# EAGLE design SparkFun_Qwiic_Micro_SAMD21E (EAGLE 9.6.2)
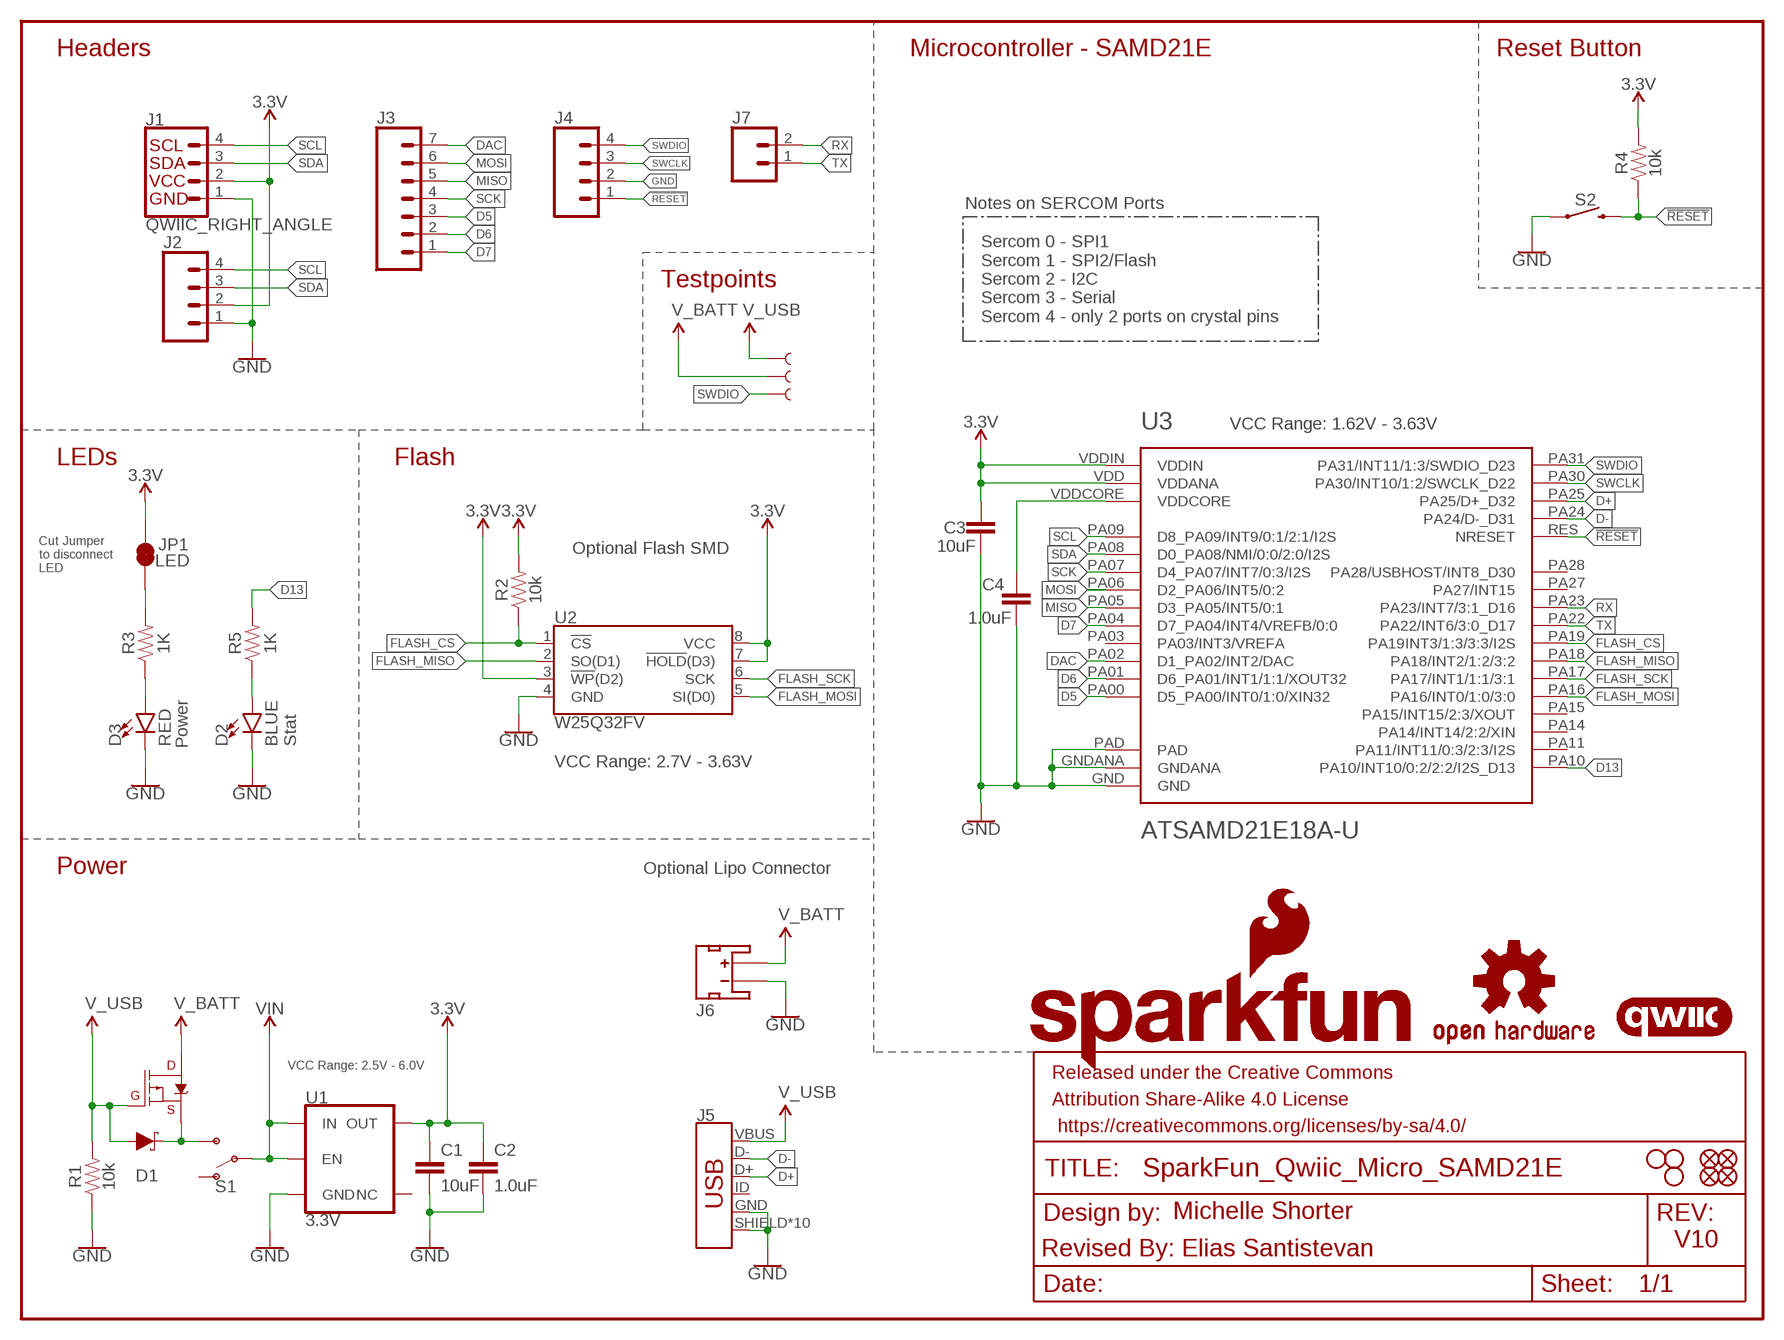
[diagram p0: schematic, sheet 1]

## Parts
C1  10uF  10UF-0603-6.3V-20%  [0603]
C2  1.0uF  1.0UF-0402-16V-10%  [0402]
C3  10uF  10UF-0603-6.3V-20%  [0603]
C4  1.0uF  1.0UF-0402-16V-10%  [0402]
D1  1A/23V/620mV  DIODE-SCHOTTKY-BAT20J  [SOD-323]
D2  BLUE  LED-BLUE0603  [LED-0603]
D3  RED  LED-RED0603  [LED-0603]
FD1  FIDUCIALUFIDUCIAL  [FIDUCIAL-MICRO]
FD2  FIDUCIALUFIDUCIAL  [FIDUCIAL-MICRO]
FD3  FIDUCIALUFIDUCIAL  [FIDUCIAL-MICRO]
FD4  FIDUCIALUFIDUCIAL  [FIDUCIAL-MICRO]
FRAME1  FRAME-LETTER  [CREATIVE_COMMONS]
H1  STAND-OFF  [STAND-OFF]
H2  STAND-OFF  [STAND-OFF]
H3  STAND-OFF  [STAND-OFF]
J1  QWIIC_RIGHT_ANGLE  QWIIC_CONNECTORJS-1MM  [JST04_1MM_RA]
J2  CONN_041X04_NO_SILK  [1X04_NO_SILK]
J3  CONN_07NO_SILK  [1X07_NO_SILK]
J4  CONN_041.27MM_NO_SILK  [1X04_1.27MM_NO_SILK]
J5  USB_MICRO-B_HALF_PTH_MILL  [USB-MICROB-PTH-MILL]
J6  JST_2MM_MALE  [JST-2-SMD]
J7  CONN_021X02_NO_SILK  [1X02_NO_SILK]
JP1  LED  JUMPER-SMT_2_NC_TRACE_SILK  [SMT-JUMPER_2_NC_TRACE_SILK]
LOGO1  SFE_LOGO_NAME.1_INCH  [SFE_LOGO_NAME_.1]
LOGO2  SFE_LOGO_FLAME.2_INCH  [SFE_LOGO_FLAME_.2]
LOGO3  OSHW-LOGOS  [OSHW-LOGO-S]
LOGO4  QWIIC_LOGO_3MM  [QWIIC_3MM]
Q1  3.1A/30V/105mΩ  MOSFET_PCH-DMG2307L  [SOT23-3]
R1  10k  10KOHM-0402-1/16W-1%  [0402]
R2  10k  10KOHM-0402-1/16W-1%  [0402]
R3  1K  1KOHM-0402-1/16W-1%  [0402]
R4  10k  10KOHM-0402-1/16W-1%  [0402]
R5  1K  1KOHM-0402-1/16W-1%  [0402]
S1  SWITCH-SPDT-SMD-RIGHT-ANGLE  [SWITCH_SPST_SMD_A]
S2  MOMENTARY-SWITCH-SPST-SMD-4.6X2.8MM  [TACTILE_SWITCH_SMD_4.6X2.8MM]
TP1  TEST-POINTTP_15TH_THRU  [TP_15TH]
TP2  TEST-POINTTP_15TH_THRU  [TP_15TH]
TP3  TEST-POINTTP_15TH_THRU  [TP_15TH]
U1  3.3V  V_REG_AP2112K-3.3V  [SOT23-5]
U2  W25Q32FV  W25Q32FVSS  [SOIC-8]
U3  ATSAMD21E18A-U  [QFN-32_SAMD]

## Nets
3.3V: C1.1 C2.1 C3.1 J1.2 J2.2 JP1.2 R2.2 R4.2 U1.5(OUT) U2.3(!WP!(D2)) U2.7(!HOLD!(D3)) U2.8(VCC) U3.VDD(VDDANA) U3.VDDIN
!RESET: J4.1 R4.1 S2.3 S2.4 U3.RES(NRESET)
D5: J3.3 U3.PA00(D5_PA00/INT0/1:0/XIN32)
D6: J3.2 U3.PA01(D6_PA01/INT1/1:1/XOUT32)
D7: J3.1 U3.PA04(D7_PA04/INT4/VREFB/0:0)
D13: R5.2 U3.PA10(PA10/INT10/0:2/2:2/I2S_D13)
D+: J5.D+ U3.PA25(PA25/D+_D32)
D-: J5.D- U3.PA24(PA24/D-_D31)
DAC: J3.7 U3.PA02(D1_PA02/INT2/DAC)
FLASH_CS: R2.1 U2.1(!CS!) U3.PA19(PA19INT3/1:3/3:3/I2S)
FLASH_MISO: U2.2(SO(D1)) U3.PA18(PA18/INT2/1:2/3:2)
FLASH_MOSI: U2.5(SI(D0)) U3.PA16(PA16/INT0/1:0/3:0)
FLASH_SCK: U2.6(SCK) U3.PA17(PA17/INT1/1:1/3:1)
GND: C1.2 C2.2 C3.2 C4.1 D2.C D3.C J1.1 J2.1 J4.2 J5.GND J5.SHIELD J5.SHIELD2(SHIELD) J5.SHIELD3(SHIELD) J5.SHIELD4(SHIELD) J5.SHIELD5(SHIELD) J5.SHIELD6(SHIELD) J5.SHIELD7(SHIELD) J5.SHIELD8(SHIELD) J5.SHIELD9(SHIELD) J5.SHIELD10(SHIELD) J6.1(-) R1.1 S2.1 S2.2 U1.2(GND) U2.4(GND) U3.GND U3.GNDANA U3.PAD
MISO: J3.5 U3.PA05(D3_PA05/INT5/0:1)
MOSI: J3.6 U3.PA06(D2_PA06/INT5/0:2)
N$1: D3.A R3.1
N$2: JP1.1 R3.2
N$4: D2.A R5.1
RX: J7.2 U3.PA23(PA23/INT7/3:1_D16)
SCK: J3.4 U3.PA07(D4_PA07/INT7/0:3/I2S)
SCL: J1.4 J2.4 U3.PA09(D8_PA09/INT9/0:1/2:1/I2S)
SDA: J1.3 J2.3 U3.PA08(D0_PA08/NMI/0:0/2:0/I2S)
SWCLK: J4.3 U3.PA30(PA30/INT10/1:2/SWCLK_D22)
SWDIO: J4.4 TP3.P$1 U3.PA31(PA31/INT11/1:3/SWDIO_D23)
TX: J7.1 U3.PA22(PA22/INT6/3:0_D17)
V_BATT: J6.2(+) Q1.3(D) TP2.P$1
V_USB: D1.A J5.VBUS Q1.1(G) R1.2 TP1.P$1
VDDCORE: C4.2 U3.VDDCORE
VIN: S1.2(P) U1.1(IN) U1.3(EN)
VIN1: D1.C Q1.2(S) S1.3(S)
Unconnected: J5.ID J6.NC1(PAD1) J6.NC2(PAD2) S1.1(O) U1.4(NC) U3.PA03(PA03/INT3/VREFA) U3.PA11(PA11/INT11/0:3/2:3/I2S) U3.PA14(PA14/INT14/2:2/XIN) U3.PA15(PA15/INT15/2:3/XOUT) U3.PA27(PA27/INT15) U3.PA28(PA28/USBHOST/INT8_D30)

## Notes on the sheet
- Headers | Microcontroller - SAMD21E | Reset Button
- Notes on SERCOM Ports
- Testpoints
- Sercom 0 - SPI1
  Sercom 1 - SPI2/Flash
  Sercom 2 - I2C
  Sercom 3 - Serial
  Sercom 4 - only 2 ports on crystal pins
- U3 | VCC Range: 1.62V - 3.63V
- LEDs | Flash
- Optional Flash SMD
- Cut Jumper 
  to disconnect
  LED
- Power | Stat
- VCC Range: 2.7V - 3.63V
- Power | Optional Lipo Connector
- VCC Range: 2.5V - 6.0V
- Michelle Shorter
- V10
- Revised By: Elias Santistevan

## Library data of the parts
C1 C3 = SparkFun-Capacitors:10UF: 10.0µF ceramic capacitors A capacitor is a passive two-terminal electrical component used to store electrical energy temporarily in an electric field.; PROD_ID: CAP-11015
C2 C4 = SparkFun-Capacitors:1.0UF: 1µF ceramic capacitors A capacitor is a passive two-terminal electrical component used to store electrical energy temporarily in an electric field.; PROD_ID: CAP-12417
D1 = SparkFun-DiscreteSemi:DIODE-SCHOTTKY: Schottky diode A Schottky diode is a semiconductor diode which has a low forward voltage drop and a very fast switching action.; PROD_ID: DIO-11623
D2 = SparkFun-LED:LED-BLUE: Blue SMD LED Used in manufacturing of various products at SparkFun Packages: 0603 - SMD 0603 package [Product Link] <http://www.digikey.com/product-detail/en/SMLE12BC7TT86/511-1589-2-ND/1641808> 1206 - SMD1206 package [Product Link] <http://www.digikey.com/product-detail/en/lite-on-inc/LTST-C150TBKT/160-1643-1-ND/573584> SparkFun Products: ESP8266 Thing-Dev Board <https://www.sparkfun.com/products/13711> RedBoard <https://www.sparkfun.com/products/12757>; PROD_ID: DIO-08575
D3 = SparkFun-LED:LED-RED: Red SMD LED Used in manufacturing of most products at SparkFun Packages: 0603 - SMD 0603 package [Product Link] <http://docs.avagotech.com/docs/AV02-0551EN> 0603 SMART - SMD 0603 SMART package ( more efficient and expensive)[Product Link] <http://www.osram-os.com/Graphics/XPic2/00077099_0.pdf> 1206 - SMD1206 package [Product Link] <https://www.sparkfun.com/datasheets/DevTools/LilyPad/Q150OVS4.pdff> SparkFun Products: Pro Mini 328 -5V <https://www.sparkfun.com/products/821> RedBoard <https://www.sparkfun.com/products/12757> IOIO-OTG <https://www.sparkfun.com/products/13613>; PROD_ID: DIO-00819
FD1-FD4 = SparkFun-Aesthetics:FIDUCIAL: Fiducial Alignment Points Point-of-reference for pick-and-place machines and other optical instruments.
FRAME1 = SparkFun-Aesthetics:FRAME-LETTER: Schematic Frame - Letter Standard 8.5x11 US Letter frame
H1-H3 = SparkFun-Hardware:STAND-OFF: Stand Off Drill holes for mechanically mounting via screws, standoffs, etc. Note: Use the keepout ring to avoid running the screw head into surrounding components. Variant Overviews STAND-OFF - Mechanical footprint for a #4 phillips button head screw. STAND-OFF-TIGHT - Mechanical footprint for a #4 phillips button head screw, Example SparkFun Products Screw - Phillips Head (1/4", 4-40, 10 pack) <https://www.sparkfun.com/products/10453> (PRT-10453) Screw - Phillips Head (1/2", 4-40, 10 pack) <https://www.sparkfun.com/products/10452> (PRT-10452) Screw - Phillips Head (3/4", 4-40, 10 pack) <https://www.sparkfun.com/products/10451> (PRT-10451) Screw - Phillips Head (1", 4-40, 10 pack) <https://www.sparkfun.com/products/10450> (PRT-10450)
J1 = SparkFun-Connectors:QWIIC_CONNECTOR: SparkFun I2C Standard Qwiic Connector An SMD 1mm pitch JST connector makes it easy and quick (get it? Qwiic?) to connect I2C devices to each other. The Qwiic system <http://www.sparkfun.com/qwiic> enables fast and solderless connection between popular platforms and various sensors and actuators. We carry 200mm <https://www.sparkfun.com/products/14204>, 100mm <https://www.sparkfun.com/products/14205>, 50mm <https://www.sparkfun.com/products/14206>, and breadboard friendly <https://www.sparkfun.com/products/14207> Qwiic cables. We also offer 10 pcs strips <https://www.sparkfun.com/products/14323> the SMD connectors.; PROD_ID: CONN-13694
J2 = SparkFun-Connectors:CONN_04: Multi connection point. Often used as Generic Header-pin footprint for 0.1 inch spaced/style header connections On any of the 0.1 inch spaced packages, you can populate with these: Break Away Headers - Straight <https://www.sparkfun.com/products/116> (PRT-00116) Break Away Male Headers - Right Angle <https://www.sparkfun.com/products/553> (PRT-00553) Female Headers <https://www.sparkfun.com/products/115> (PRT-00115) Break Away Headers - Machine Pin <https://www.sparkfun.com/products/117> (PRT-00117) Break Away Female Headers - Swiss Machine Pin <https://www.sparkfun.com/products/743> (PRT-00743) For SCREWTERMINALS and SPRING TERMINALS visit here: Screw Terimnals on SparkFun.com <https://www.sparkfun.com/search/results?term=Screw+Terminals> (5mm/3.5mm/2.54mm spacing) This device is also useful as a general connection point to wire up your design to another part of your project. Our various solder wires solder well into these plated through hole pads. Hook-Up Wire - Assortment (Stranded, 22 AWG) <https://www.sparkfun.com/products/11375> (PRT-11375) Hook-Up Wire - Assortment (Solid Core, 22 AWG) <https://www.sparkfun.com/products/11367> (PRT-11367) View the entire wire category on our website here <https://www.sparkfun.com/categories/141> Special notes: Molex polarized connector foot print use with SKU : PRT-08231 with associated crimp pins and housings. 1MM SMD Version SKU: PRT-10208; PROD_ID: CONN-09696
J3 = SparkFun-Connectors:CONN_07: Multi connection point. Often used as Generic Header-pin footprint for 0.1 inch spaced/style header connections On any of the 0.1 inch spaced packages, you can populate with these: Break Away Headers - Straight <https://www.sparkfun.com/products/116> (PRT-00116) Break Away Male Headers - Right Angle <https://www.sparkfun.com/products/553> (PRT-00553) Female Headers <https://www.sparkfun.com/products/115> (PRT-00115) Break Away Headers - Machine Pin <https://www.sparkfun.com/products/117> (PRT-00117) Break Away Female Headers - Swiss Machine Pin <https://www.sparkfun.com/products/743> (PRT-00743) For SCREWTERMINALS and SPRING TERMINALS visit here: Screw Terimnals on SparkFun.com <https://www.sparkfun.com/search/results?term=Screw+Terminals> (5mm/3.5mm/2.54mm spacing) This device is also useful as a general connection point to wire up your design to another part of your project. Our various solder wires solder well into these plated through hole pads. Hook-Up Wire - Assortment (Stranded, 22 AWG) <https://www.sparkfun.com/products/11375> (PRT-11375) Hook-Up Wire - Assortment (Solid Core, 22 AWG) <https://www.sparkfun.com/products/11367> (PRT-11367) View the entire wire category on our website here <https://www.sparkfun.com/categories/141> Special notes: Molex polarized connector foot print use with SKU : PRT-08231 with associated crimp pins and housings. 1MM SMD Version SKU: PRT-10208 NOTES ON THE VARIANTS LOCK and LOCK_LONGPADS... This footprint was designed to help hold the alignment of a through-hole component (i.e. 6-pin header) while soldering it into place. You may notice that each hole has been shifted either up or down by 0.005 of an inch from it's more standard position (which is a perfectly straight line). This slight alteration caused the pins (the squares in the middle) to touch the edges of the holes. Because they are alternating, it causes a "brace" to hold the component in place. 0.005 has proven to be the perfect amount of "off-center" position when using our standard breakaway headers. Although looks a little odd when you look at the bare footprint, once you have a header in there, the alteration is very hard to notice. Also,if you push a header all the way into place, it is covered up entirely on the bottom side.
J4 = SparkFun-Connectors:CONN_04: Multi connection point. Often used as Generic Header-pin footprint for 0.1 inch spaced/style header connections On any of the 0.1 inch spaced packages, you can populate with these: Break Away Headers - Straight <https://www.sparkfun.com/products/116> (PRT-00116) Break Away Male Headers - Right Angle <https://www.sparkfun.com/products/553> (PRT-00553) Female Headers <https://www.sparkfun.com/products/115> (PRT-00115) Break Away Headers - Machine Pin <https://www.sparkfun.com/products/117> (PRT-00117) Break Away Female Headers - Swiss Machine Pin <https://www.sparkfun.com/products/743> (PRT-00743) For SCREWTERMINALS and SPRING TERMINALS visit here: Screw Terimnals on SparkFun.com <https://www.sparkfun.com/search/results?term=Screw+Terminals> (5mm/3.5mm/2.54mm spacing) This device is also useful as a general connection point to wire up your design to another part of your project. Our various solder wires solder well into these plated through hole pads. Hook-Up Wire - Assortment (Stranded, 22 AWG) <https://www.sparkfun.com/products/11375> (PRT-11375) Hook-Up Wire - Assortment (Solid Core, 22 AWG) <https://www.sparkfun.com/products/11367> (PRT-11367) View the entire wire category on our website here <https://www.sparkfun.com/categories/141> Special notes: Molex polarized connector foot print use with SKU : PRT-08231 with associated crimp pins and housings. 1MM SMD Version SKU: PRT-10208
J5 = SparkFun-Connectors:USB_MICRO-B: USB Type Micro-B Connector Male/female and PTH/SMT variants SparkFun Products: SparkFun microB USB Breakout <https://www.sparkfun.com/products/12035> SparkFun USB microB Plug Breakout <https://www.sparkfun.com/products/10031> SparkFun ESP8266 Thing <https://www.sparkfun.com/products/13231>; PROD_ID: CONN-13711
J6 = SparkFun-Connectors:JST_2MM_MALE: JST 2MM MALE RA CONNECTOR Two pin, compact surface mount connector. Commonly used as a battery input connection point. We really like the solid locking feeling and high current rating on these small connectors. We use these all the time as battery connectors. Mates to single-cell LiPo batteries. Here is the connector we sell at SparkFun: JST Right Angle Connector - White <https://www.sparkfun.com/products/8612> (PRT-08612) Datasheet <http://www.sparkfun.com/datasheets/Prototyping/Connectors/JST-Horizontal.pdf> It was used on these SparkFun products: SparkFun MOSFET Power Controller <https://www.sparkfun.com/products/11214> (PRT-11214) SparkFun Battery Babysitter - LiPo Battery Manager <https://www.sparkfun.com/products/13777> (PRT-13777) And many, many others that required a lipo battery connection.; PROD_ID: CONN-11443; SF_ID: PRT-08612
J7 = SparkFun-Connectors:CONN_02: Multi connection point. Often used as Generic Header-pin footprint for 0.1 inch spaced/style header connections On any of the 0.1 inch spaced packages, you can populate with these: Break Away Headers - Straight <https://www.sparkfun.com/products/116> (PRT-00116) Break Away Male Headers - Right Angle <https://www.sparkfun.com/products/553> (PRT-00553) Female Headers <https://www.sparkfun.com/products/115> (PRT-00115) Break Away Headers - Machine Pin <https://www.sparkfun.com/products/117> (PRT-00117) Break Away Female Headers - Swiss Machine Pin <https://www.sparkfun.com/products/743> (PRT-00743) For SCREWTERMINALS and SPRING TERMINALS visit here: Screw Terimnals on SparkFun.com <https://www.sparkfun.com/search/results?term=Screw+Terminals> (5mm/3.5mm/2.54mm spacing) This device is also useful as a general connection point to wire up your design to another part of your project. Our various solder wires solder well into these plated through hole pads. Hook-Up Wire - Assortment (Stranded, 22 AWG) <https://www.sparkfun.com/products/11375> (PRT-11375) Hook-Up Wire - Assortment (Solid Core, 22 AWG) <https://www.sparkfun.com/products/11367> (PRT-11367) View the entire wire category on our website here <https://www.sparkfun.com/categories/141> Special notes: Molex polarized connector foot print use with: PRT-08233 with associated crimp pins and housings. 2.54_SCREWTERM for use with PRT-10571. 3.5mm Screw Terminal footprints for PRT-08084 5mm Screw Terminal footprints for use with PRT-08432
JP1 = SparkFun-Jumpers:JUMPER-SMT_2_NC_TRACE: Normally closed trace jumper This jumper has a trace between two pads so it's normally closed (NC). Use a razor knife to open the connection. For best results follow the IPC guidelines for cutting traces: Cutout at least 0.063 mm (0.005 in). Remove all loose material to clean up the cut area. Seal the cut with an approved epoxy. Reapply solder to reclose the connection.
LOGO1 = SparkFun-Aesthetics:SFE_LOGO_NAME: SparkFun Font Logo This is the SparkFun name logo. The logo on the schematic will always be the same size; the package variant is the height of the flame part of the logo (or the height the flame would be, if it were drawn). Default layer for the logo on the board is tSilk.
LOGO2 = SparkFun-Aesthetics:SFE_LOGO_FLAME: SparkFun Flame Logo This is the SparkFun flame logo. The logo on the schematic will always be the same size; the package variant is the height of the flame. Default layer for the logo on the board is tSilk.
LOGO3 = SparkFun-Aesthetics:OSHW-LOGO: Open-Source Hardware (OSHW) Logo This logo indicates the piece of hardware it is found on incorporates a OSHW license and/or adheres to the definition of open source hardware found here: http://freedomdefined.org/OSHW
LOGO4 = SparkFun-Aesthetics:QWIIC_LOGO: Qwiic Logos for placement on schematic and PCB. The 5.5mm silk logo is best for placing next to Qwiic connector.
Q1 = SparkFun-DiscreteSemi:MOSFET_PCH: P-channel MOSFETs Voltage controlled devices that allow control of high current outputs. SparkFun Products: SparkFun ESP32 Thing <https://www.sparkfun.com/products/13907> SparkFun ESP8266 Thing <https://www.sparkfun.com/products/13231> SparkFun Pi Servo HAT V2 <https://www.sparkfun.com/products/15316> DMG2305UX-7 (20V/4.2A/SOT23-3); PROD_ID: TRANS-11308
R1 R2 R4 = SparkFun-Resistors:10KOHM: 10kΩ resistor A resistor is a passive two-terminal electrical component that implements electrical resistance as a circuit element. Resistors act to reduce current flow, and, at the same time, act to lower voltage levels within circuits. - Wikipedia; PROD_ID: RES-14241
R3 R5 = SparkFun-Resistors:1KOHM: 1kΩ resistor A resistor is a passive two-terminal electrical component that implements electrical resistance as a circuit element. Resistors act to reduce current flow, and, at the same time, act to lower voltage levels within circuits. - Wikipedia; PROD_ID: RES-14342
S1 = SparkFun-Switches:SWITCH-SPDT: Single Pole, Double Throw (SPDT) Switch Single-pole, double-throw (SPDT) switch. Variant Overview SMD-AYZ0202 Surface Mount DPDT Switch <https://www.sparkfun.com/products/597> (COM-00597) Used on e.g. LilyPad Arduino USB - ATmega32U4 Board <https://www.sparkfun.com/products/12049> PTH-11.6X4.0MM SPDT Mini Power Switch <https://www.sparkfun.com/products/102> (COM-00102) Used on e.g. SparkFun Simon Says - Through-Hole Soldering Kit <https://www.sparkfun.com/products/10547> (KIT-10547) PTH-11.6X4.0MM-KIT KIT version of SPDT Mini Power Switch - Simplifies soldering by removing tStop of switch pins - only one side can be soldered. PTH-11.6X4.0MM-LOCK LOCK version of SPDT Mini Power Switch - Offset pins hold switch in place for easier soldering. SMD-RIGHT-ANGLE Surface Mount Right Angle Switch <https://www.sparkfun.com/products/10860> (COM-10860) Used on e.g. SparkFun ESP8266 Thing <https://www.sparkfun.com/products/13231>; PROD_ID: SWCH-10651; SF_SKU: COM-10860
S2 = SparkFun-Switches:MOMENTARY-SWITCH-SPST: Momentary Switch (Pushbutton) - SPST Normally-open (NO) SPST momentary switches (buttons, pushbuttons). Variants PTH-12MM - 12mm square, through-hole Momentary Pushbutton Switch - 12mm Square <https://www.sparkfun.com/products/9190> (COM-09190) PTH-6.0MM, PTH-6.0MM-KIT - 6.0mm square, through-hole Mini Pushbutton Switch <https://www.sparkfun.com/products/97> (COM-00097) KIT package intended for soldering kit's - only one side of pads' copper is exposed. PTH-RIGHT-ANGLE-KIT - Right-angle, through-hole Right Angle Tactile Button <https://www.sparkfun.com/products/10791> - Used on SparkFun BigTime Watch Kit <https://www.sparkfun.com/products/11734> SMD-12MM - 12mm square, surface-mount Tactile Button - SMD (12mm) <https://www.sparkfun.com/products/12993> (COM-12993) Used on SparkFun PicoBoard <https://www.sparkfun.com/products/11888> SMD-4.5MM - 4.5mm Square Trackball Switch Used on SparkFun Blackberry Trackballer Breakout <https://www.sparkfun.com/products/13169> SMD-4.6MMX2.8MM - 4.60mm x 2.80mm, surface mount Used on SparkFun Pro Micro - RP2040 <https://www.sparkfun.com/products/17717> SMD-5.2MM, SMD-5.2-REDUNDANT - 5.2mm square, surface-mount Mini Pushbutton Switch - SMD <https://www.sparkfun.com/products/8720> (COM-08720) Used on Arduino Pro Mini <https://www.sparkfun.com/products/11114> REDUNDANT package connects both switch circuits together SMD-6.0X3.5MM - 6.0 x 3.5mm, surface mount Momentary Reset Switch SMD <https://www.sparkfun.com/products/8229> (COM-08229) SMD-6.2MM-TALL - 6.2mm square, surface mount Tactile Button - SMD (6mm) <https://www.sparkfun.com/products/12992> Used on SparkFun Digital Sandbox <https://www.sparkfun.com/products/12651> SMD-RIGHT-ANGLE - Right-angle, surface mount Used on SparkFun Block for Intel® Edison - Arduino <https://www.sparkfun.com/products/13036>; PROD_ID: SWCH-15606
TP1-TP3 = SparkFun-Connectors:TEST-POINT: SparkFun Test Points Bare copper test points for troubleshooting or In-Circuit-Testing. These are used by our Production team for verifying production board runs using pogo-pins on test beds. SparkFun Products: SparkFun LSM9DS1 Breakout <https://www.sparkfun.com/products/13284> SparkFun PSOC <https://www.sparkfun.com/products/13714> SparkFun Load Cell Amplifier <https://www.sparkfun.com/products/13879>
U1 = SparkFun-IC-Power:V_REG_AP2112: AP2112 - 600mA CMOS LDO Regulator w/ Enable The AP2112 is CMOS process low dropout linear regulator with enable function, the regulator delivers a guaranteed 600mA (min.) continuous load current. Features Output Voltage Accuracy: ±1.5% Output Current: 600mA (Min.) Foldback Short Current Protection: 50mA Enable Function to Turn ON/OFF VOUT Low Dropout Voltage (3.3V): 250mV (Typ.) @IOUT=600mA Excellent Load Regulation: 0.2%/A (Typ.) Excellent Line Regulation: 0.02%/V (Typ.) Low Quiescent Current: 55μA (Typ.) Low Standby Current: 0.01μA (Typ.) Low Output Noise: 50μVRMS PSRR: 100Hz -65dB, 1kHz -65dB OTSD Protection Stable with 1.0μF Flexible Cap: Ceramic, Tantalum and Aluminum Electrolytic Operation Temperature Range: -40°C to 85°C ESD: MM 400V, HBM 4000V; PROD_ID: VREG-12457
U2 = SparkFun-IC-Memory:W25Q32FV: W25Q32FV 32Mb (4MB) Serial Flash Memory The W25Q32FV support the standard Serial Peripheral Interface (SPI), Dual/Quad I/O SPI as well as 2-clocks instruction cycle Quad Peripheral Interface (QPI). 104MHz, SPI, 8-SOIC-EIAJ Datasheet <http://www.winbond.com/resource-files/w25q32fv%20revh%20091613.pdf> SparkFun Products SparkFun Blynk Board - ESP8266 <https://www.sparkfun.com/products/13794> (WRL-13794); PROD_ID: IC-13229
U3 = SparkFun-IC-Microcontroller:ATSAMD21E18A-U: SAM D21E 32-Pin QFN The SAMD21E is built around the 32-bit ARM Cortex-M0+ processor with up to 256KB of Flash and 32KB of SRAM. It operates at a maximum frequency of 48MHz.; PROD_ID: IC-14428

## Net classes
1 vcc: width 0 mm

## Board
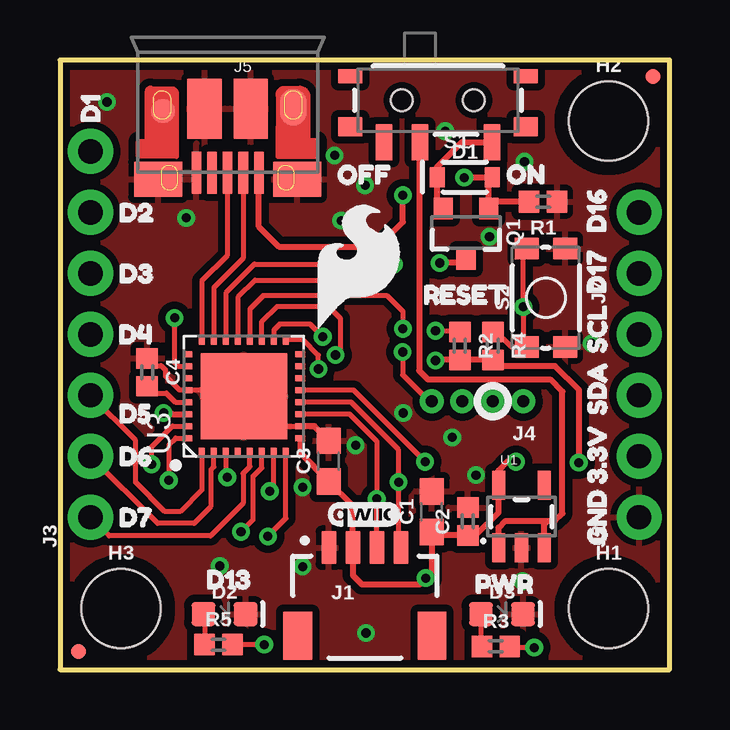
[diagram p1: board, top side]
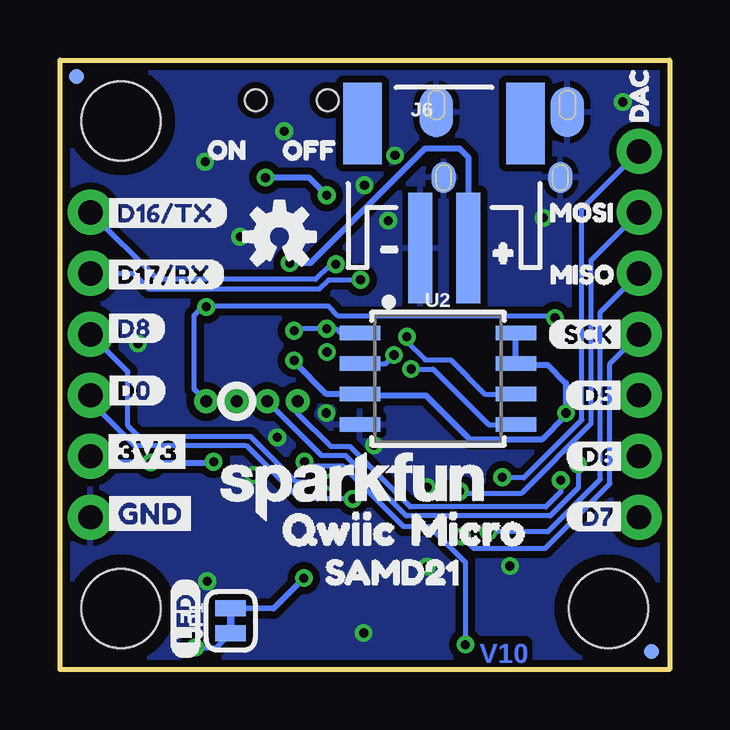
[diagram p2: board, bottom side, seen from below]

Size 25.4 x 25.4 mm. Coordinates in mm from the lower left corner, seen from the top.
Outline: 0,0 25.4,0 25.4,25.4 0,25.4 0,0
Copper layers (1*16): Top 0.035mm / dielectric 1.5mm / Bottom 0.035mm
Design rules "SparkFun-2-layer-TIGHT": minimum track width 7mil, minimum drill 15mil, track to track 7mil, track to pad 7mil, pad to pad 7mil, via to via 7mil, smd to smd 7mil, copper to edge 7mil, drill to drill 7mil, minimum pad ring 7mil, minimum via ring 7mil, stop-mask expansion 4mil, vias tented up to drill 25mil, thermal gap 10mil

### Footprints (pad centres in the part's own frame; a part is rotated, then mirrored left to right if it is on the bottom)
0603 = smd 1.1 x 1: 1 -0.85,0; 2 0.85,0
0402 = smd 0.85 x 0.9: 1 -0.58,0; 2 0.58,0
SOD-323 = smd 0.63 x 0.83: A 1.15,0; C -1.15,0
LED-0603 = smd 1 x 1: A -0.877,0; C 0.877,0
FIDUCIAL-MICRO = smd 0.635 x 0.635: 1 0,0
STAND-OFF = hole 3.302: 0,0
JST04_1MM_RA = smd 0.6 x 1.35: 1 -1.5,0; 2 -0.5,0; 3 0.5,0; 4 1.5,0 | smd 1.2 x 2: NC1 2.8,-3.675; NC2 -2.8,-3.675
1X04_NO_SILK = drill 1.016 pad 1.88: 1 0,0; 2 2.54,0; 3 5.08,0; 4 7.62,0
1X07_NO_SILK = drill 1.016 pad 1.88: 1 0,0; 2 2.54,0; 3 5.08,0; 4 7.62,0; 5 10.16,0; 6 12.7,0; 7 15.24,0
1X04_1.27MM_NO_SILK = drill 0.508 pad 1: 1 0,0; 2 1.27,0; 3 2.54,0; 4 3.81,0
USB-MICROB-PTH-MILL = smd 0.4 x 1.75: D+ 0,0; D- -0.65,0; GND 1.3,0; ID 0.65,0; VBUS -1.3,0 | smd 2 x 1.46: SHIELD -2.9,0.275; SHIELD2 2.9,0.275 | smd 1.425 x 2.5: SHIELD3 -0.963,-2.675; SHIELD4 0.963,-2.675 | smd 1.4 x 2.1 bottom: SHIELD5 -2.731,-2.531; SHIELD7 2.729,-2.531 | smd 1 x 1: SHIELD6 2.7,-2.575 | smd 1.1 x 1.5: SHIELD8 -2.731,-2.731 | smd 1 x 1.3 bottom: SHIELD9 -2.43,0.195; SHIELD10 2.43,0.195
JST-2-SMD = smd 1 x 4.6: 1 -1,-3.7; 2 1,-3.7 | smd 1.6 x 3.4: NC1 -3.4,1.5; NC2 3.4,1.5
1X02_NO_SILK = drill 1.016 pad 1.88: 1 0,0; 2 2.54,0
SMT-JUMPER_2_NC_TRACE_SILK = smd 0.66 x 1.27: 1 -0.521,0; 2 0.521,0
SOT23-3 = smd 0.8 x 0.9: 1 -0.95,-1; 2 0.95,-1; 3 0,1.1
SWITCH_SPST_SMD_A = smd 0.7 x 1.5: 1 -2.25,-1.75; 2 -0.75,-1.75; 3 2.25,-1.75 | smd 1 x 0.6: GND1 -3.65,1; GND3 3.65,1 | smd 1 x 0.8: GND2 -3.65,-1.1; GND4 3.65,-1.1 | hole 0.9: -1.5,0; 1.5,0
TACTILE_SWITCH_SMD_4.6X2.8MM = smd 0.9 x 1: 1 -2.05,-0.8; 2 2.05,-0.8; 3 2.05,0.8; 4 -2.05,0.8
TP_15TH = drill 0.381 pad 0.61: P$1 0,0
SOT23-5 = smd 0.55 x 1.2: 1 -0.95,-1.3; 2 0,-1.3; 3 0.95,-1.3; 4 0.95,1.3; 5 -0.95,1.3
SOIC-8 = smd 0.61 x 1.702: 1 -1.905,-3.251; 2 -0.635,-3.251; 3 0.635,-3.251; 4 1.905,-3.251; 5 1.905,3.251; 6 0.635,3.251; 7 -0.635,3.251; 8 -1.905,3.251
QFN-32_SAMD = smd 0.25 x 0.4: GND 0.21,2.31; GNDANA -1.29,-2.39; PA08 -0.79,-2.39; PA09 -0.29,-2.39; PA10 0.21,-2.39; PA11 0.71,-2.39; PA14 1.21,-2.39; PA15 1.71,-2.39; PA27 1.71,2.31; PA28 0.71,2.31; PA30 -1.29,2.31; PA31 -1.79,2.31; RES 1.21,2.31; VDD -1.79,-2.39; VDDCORE -0.29,2.31; VDDIN -0.79,2.31 | smd 0.4 x 0.25: PA00 -2.39,1.71; PA01 -2.39,1.21; PA02 -2.39,0.71; PA03 -2.39,0.21; PA04 -2.39,-0.29; PA05 -2.39,-0.79; PA06 -2.39,-1.29; PA07 -2.39,-1.79; PA16 2.31,-1.79; PA17 2.31,-1.29; PA18 2.31,-0.79; PA19 2.31,-0.29; PA22 2.31,0.21; PA23 2.31,0.71; PA24 2.31,1.21; PA25 2.31,1.71 | smd 3.6 x 3.6: PAD -0.04,-0.04

### Placement (x,y rotation side)
C1  15.49,6.58 90 top
C2  16.99,6.17 90 top
C3  11.2,8.69 90 top
C4  3.63,12.39 270 top
D1  16.87,20.52 0 top
D2  6.86,2.31 0 top
D3  18.41,2.31 0 top
FD1  24.71,24.71 0 bottom
FD2  0.76,0.76 0 top
FD3  24.71,24.71 0 top
FD4  0.76,0.76 0 bottom
FRAME1  -13.72,-20.07 0 top  (outside the outline)
H1  22.86,2.54 0 top
H2  22.86,22.86 0 top
H3  2.54,2.54 0 top
J1  12.7,5.08 0 top
J2  24.13,6.35 90 top
J3  1.27,6.35 90 top
J4  19.3,11.18 180 top
J5  6.99,20.7 180 top
J6  9.4,21.26 0 bottom
J7  24.13,16.51 90 top
JP1  18.29,2.03 90 bottom
LOGO1  13.21,7.62 0 bottom
LOGO2  12.45,16.76 0 top
LOGO3  16.26,18.03 0 bottom
LOGO4  12.66,6.46 0 top
Q1  16.92,18.21 180 top
R1  20.13,19.49 180 top
R2  16.66,13.49 270 top
R3  18.16,0.97 0 top
R4  18.03,13.49 270 top
R5  6.6,1.04 0 top
S1  15.75,23.72 0 top
S2  20.24,15.49 90 top
TP1  16.84,20.5 0 top
TP2  15.82,16.94 0 top
TP3  14.27,13.23 0 top
U1  19.23,6.38 0 top
U2  9.65,12.12 270 bottom
U3  7.62,11.43 90 top
U$1  [D00]  23.72,11.63 0 bottom
U$2  [GND-03]  23.77,6.5 0 bottom
U$3  [#23]  13.21,17.78 0 bottom
U$4  [#24]  8.51,17.53 0 bottom
U$5  [3#3V10]  22.38,7.06 90 top
U$6  [D12]  1.27,22.1 90 top
U$7  [D166]  22.35,17.53 90 top
U$8  [D177]  22.35,14.99 90 top
U$9  [D16#TX4]  23.7,19.02 0 bottom
U$10  [QWIIC2]  17.27,5.84 0 bottom
U$11  [D17#RX3]  23.7,16.46 0 bottom
U$12  [D75]  1.78,6.35 0 top
U$13  [DAC1]  1.27,22.1 90 bottom
U$14  [MISO0]  5.68,16.46 0 bottom
U$15  [SAMD213]  15.24,4.06 0 bottom
U$16  [MOSI2]  5.69,19.05 0 bottom
U$17  [3V3-03]  23.83,9.09 0 bottom
U$18  [ON12]  19.93,21.65 0 bottom
U$19  [OFF13]  16.8,21.64 0 bottom
U$20  [SCK7]  5.23,13.97 0 bottom
U$21  [RESET0]  14.45,15.62 0 top
U$22  [D85]  23.7,14.22 0 bottom
U$23  [MICRO2]  11.94,5.84 0 bottom
U$24  [LED1]  20.17,0.39 90 bottom
U$25  [D50]  4.37,11.43 0 bottom
U$26  [D61]  4.37,8.89 0 bottom
U$27  [D72]  4.37,6.38 0 bottom
U$28  [D21]  1.78,19.05 0 top
U$29  [D136]  5.41,3.76 0 top
U$36  [D33]  1.78,16.51 0 top
U$37  [D41]  1.78,13.97 0 top
U$38  [D52]  1.79,10.67 0 top
U$39  [D65]  1.78,8.89 0 top
U$44  [GND11]  22.38,4.52 90 top
U$45  [OFF13]  10.88,20.62 0 top
U$46  [ON12]  17.92,20.64 0 top
U$47  [PWR16]  16.64,3.57 0 top
U$49  [SCL8]  22.38,12.52 90 top
U$50  [SDA9]  22.38,9.93 90 top

### Tracks (layer width: path | path; a pad name or v marks a point on that pad's centre or on a via)
3.3V  (via drill 0.38)
  Top 0.254: v4.32,10.69 4.62,10.69 4.67,10.64 U3.VDDIN | v19,8.66 18.64,8.66 18.28,8.3 U1.5 18.28,6.54 17.33,5.59 C2.1 15.63,5.59 C1.1 15.49,4.06 v15.24,3.81 14.99,3.56 12.57,3.56 12.2,3.93 J1.2 12.2,6.84 C3.1 10.01,9.03 U3.VDD | v21.61,8.62 21.61,11.66 20.62,12.65 18.29,12.65 R4.2 R2.2 15.68,12.91 v15.65,12.88
  Bottom 0.203: U2.7 6.35,12.7 6.02,12.7
  Bottom 0.254: v19,8.66 19.04,8.62 v21.61,8.62 23.1,8.62 23.37,8.89 J2.2 | U2.7 U2.8 | 6.02,12.7 5.08,12.7 4.32,11.94 v4.32,10.69 4.32,10.59 5.31,9.6 8.33,9.6 10.16,11.43 12.85,11.43 U2.3 14.3,11.48 15.65,12.83 v15.65,12.88 | v15.24,3.81 16.51,2.54 JP1.2
!RESET  (via drill 0.38)
  Top 0.203: v4.78,14.66 4.78,12.78 4.91,12.64 U3.RES | R4.1 18.31,13.79 18.46,13.79 18.81,13.44 S2.4 19.3,13.58 v19.3,15.11 19.3,17.4 S2.3
  Bottom 0.203: J4.1 19.81,11.68 19.81,14.76 19.46,15.11 v19.3,15.11 19.27,15.15 14.22,15.15 13.8,14.73 4.85,14.73 v4.78,14.66
D5
  Top 0.203: U3.PA00 5.91,7.49 5,6.58 4.37,6.58 3.15,7.8 3.15,9.55 J3.3
D6
  Top 0.203: J3.2 4.06,6.1 5.59,6.1 6.3,6.81 6.3,8.33 6.41,8.44 U3.PA01
D7
  Top 0.203: U3.PA04 7.91,8.46 7.63,8.18 7.63,6.93 6.27,5.58 2.04,5.58 J3.1
D13  (via drill 0.38)
  Top 0.203: v15.21,8.66 12.24,11.64 U3.PA10 | v8.51,1.04 R5.2
  Bottom 0.203: v8.51,1.04 8.51,4.47 10.01,5.97 11.1,5.97 13.61,8.48 15.04,8.48 v15.21,8.66
D+
  Top 0.203: U3.PA25 5.91,16.2 6.99,17.27 J5.D+
D-
  Top 0.203: J5.D- 7.63,17.14 6.41,15.92 U3.PA24
DAC  (via drill 0.38)
  Top 0.203: U3.PA02 6.91,8.08 v6.97,8.01
  Bottom 0.203: v6.97,8.01 6.95,7.99 6.07,7.99 3.66,10.4 3.66,19.2 J3.7
FLASH_CS  (via drill 0.38)
  Top 0.203: v14.29,14.2 14.29,14.92 13.61,15.6 8.48,15.6 7.91,15.02 U3.PA19 | v15.65,14.12 16.61,14.12 R2.1
  Bottom 0.203: U2.1 13.72,14.02 13.89,14.2 v14.29,14.2 15.57,14.2 v15.65,14.12
FLASH_MISO  (via drill 0.38)
  Top 0.203: v11.48,13.11 11.68,13.31 11.68,14.63 11.18,15.14 9.04,15.14 8.41,14.51 U3.PA18
  Bottom 0.203: U2.2 11.84,12.75 v11.48,13.11
FLASH_MOSI  (via drill 0.38)
  Top 0.203: v10.77,12.52 10.77,13.11 10.14,13.74 U3.PA16
  Bottom 0.203: v10.77,12.52 9.86,12.52 7.54,10.21 U2.5
FLASH_SCK  (via drill 0.38)
  Top 0.203: v10.95,13.87 10.41,14.4 9.17,14.4 8.91,14.14 U3.PA17
  Bottom 0.203: v10.95,13.87 10.95,13.66 10.19,12.9 9.12,12.9 7.7,11.48 U2.6
GND  (via drill 0.38)
  Top 0.203: 3.92,12.67 4.21,12.67 4.39,12.49 4.39,12.23 4.98,11.64 U3.GND 6.1,11.64 6.35,11.39 U3.PAD 8.15,11.39 9.4,10.14 U3.GNDANA
  Top 0.254: C4.1 3.92,12.67 | C3.2 10.6,10.14 U3.GNDANA
  other vias: 19.27,3.68 5.26,18.82 11.72,18.71 14.3,10.69 19.35,21.16 22.15,13.59 10.11,7.59 12.75,1.52 17.89,18.03 10.11,4.29 12.32,9.35 6.65,4.32 1.96,23.65 17.34,8.1 16.34,9.68 16.05,22.43 11.44,21.42 12.71,20.18
  pour Top (isolate 0.305): 0,0 0,25.4 25.4,25.4 25.4,0
  pour Bottom (isolate 0.305): 0,25.4 25.4,25.4 25.4,0 0,0
MISO  (via drill 0.38)
  Top 0.203: v7.54,5.74 8.04,6.24 8.04,8.04 8.41,8.41 U3.PA05
  Bottom 0.203: J3.5 2.88,14.9 2.88,7.94 5.08,5.74 v7.54,5.74
MOSI  (via drill 0.38)
  Top 0.203: v8.74,7.43 8.91,7.6 U3.PA06
  Bottom 0.203: v8.74,7.43 8.66,7.35 6.16,7.35 3.28,10.24 3.28,17.04 J3.6
N$1
  Top 0.203: D3.A 17.54,1.01 R3.1
N$2  (via drill 0.38)
  Top 0.203: v19.76,0.91 18.79,0.91 R3.2
  Bottom 0.203: v19.76,0.91 18.9,0.91 JP1.1
N$4
  Top 0.203: D2.A 6.02,2.27 R5.1
RX  (via drill 0.38)
  Top 0.203: v13.91,16.89 8.1,16.89 6.91,15.7 U3.PA23
  Bottom 0.203: v13.91,16.89 14.12,16.89 14.76,16.26 21.34,16.26 J7.2
SCK  (via drill 0.38)
  Top 0.203: v8.66,5.55 9.41,6.3 U3.PA07
  Bottom 0.203: v8.66,5.55 8.17,5.05 5.18,5.05 2.49,7.75 2.49,12.75 J3.4
SCL  (via drill 0.38)
  Top 0.203: U3.PA09 12.13,11.14 14.11,9.16 v14.11,7.81 14.11,5.17 J1.4
  Bottom 0.203: J2.4 22.57,12.41 22.57,10.16 22.11,9.7 17.45,9.7 15.56,7.81 v14.11,7.81
SDA  (via drill 0.38)
  Top 0.203: J1.3 v13.2,7.11 13.2,9.51 12.07,10.64 U3.PA08
  Bottom 0.203: J2.3 24.13,11.18 22.28,9.32 17.63,9.32 15.42,7.11 v13.2,7.11
SWCLK  (via drill 0.38)
  Top 0.203: v3.81,8.56 3.81,9.27 4.68,10.14 U3.PA30
  Bottom 0.203: v3.81,8.56 3.81,7.57 4.98,6.4 10.97,6.4 13.49,8.91 14.5,8.91 J4.3
SWDIO  (via drill 0.38)
  Top 0.203: v4.53,7.89 4.53,9.36 4.81,9.64 U3.PA31 | TP3.P$1 14.28,12.28 15.38,11.18 J4.4
  Bottom 0.203: v4.53,7.89 4.53,7.4 5.16,6.78 10.81,6.78 13.32,9.3 14.12,9.3 15.49,10.67 J4.4
TX  (via drill 0.38)
  Top 0.203: v12.88,16.24 12.87,16.23 8.13,16.23 7.41,15.51 U3.PA22
  Bottom 0.203: J7.1 22.35,16.51 21.7,15.86 14.59,15.86 14.21,16.24 v12.88,16.24
V_BATT
  Top 0.254: Q1.3 16.75,16.94 TP2.P$1
  Bottom 0.254: TP2.P$1 14.96,16.94 10.19,21.72 8.76,21.72 8.4,21.35 J6.2
V_USB  (via drill 0.38)
  Top 0.254: R1.2 18.15,19.49 Q1.1 17.87,20.37 D1.A 17.99,20.5 TP1.P$1 | J5.VBUS 8.29,18.46 9.12,17.63 13.26,17.63 14.29,18.66 v14.29,19.76
  Bottom 0.254: v14.29,19.76 15.02,20.5 TP1.P$1
VDDCORE
  Top 0.203: 3.92,11.52 4.43,11.52 4.81,11.14 U3.VDDCORE
  Top 0.254: C4.2 3.92,11.52
VIN
  Top 0.254: S1.2 14.96,21.94 14.96,12.46 15.33,12.09 20.42,12.09 20.93,11.58 20.93,6.5 20.62,6.2 20.32,6.2 | U1.1 18.28,5.92 18.56,6.2 20.32,6.2 | U1.3 20.18,6.05 20.32,6.2
VIN1
  Top 0.254: Q1.2 15.72,19.46 D1.C 15.72,20.95 16.74,21.97 S1.3

### Text on the board
Bottom: V10
Measures: Units in Inches
tDocu: Michelle Shorter | Revised By: Elias Santistevan